# Altium schematic sheet TEST_MECH.SchDoc
size 420 x 297 mm; SheetNumber: 3
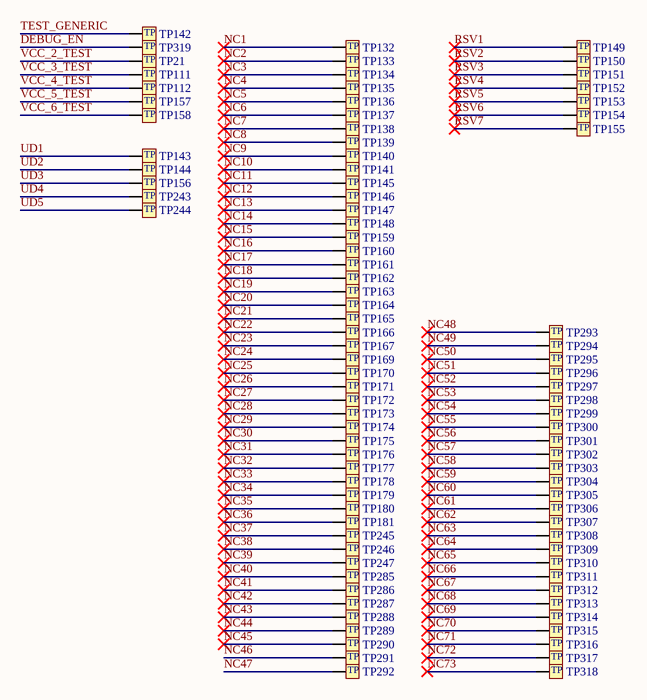
[diagram p0: TEST_MECH.SchDoc]

## Parts
TP21  TP_0P8MM  [TP_0P8MM]  (value not drawn)  (no BOM)
TP111  TP_0P8MM  [TP_0P8MM]  (value not drawn)  (no BOM)
TP112  TP_0P8MM  [TP_0P8MM]  (value not drawn)  (no BOM)
TP132  TP_0P8MM  [TP_0P8MM]  (value not drawn)  (no BOM)
TP133  TP_0P8MM  [TP_0P8MM]  (value not drawn)  (no BOM)
TP134  TP_0P8MM  [TP_0P8MM]  (value not drawn)  (no BOM)
TP135  TP_0P8MM  [TP_0P8MM]  (value not drawn)  (no BOM)
TP136  TP_0P8MM  [TP_0P8MM]  (value not drawn)  (no BOM)
TP137  TP_0P8MM  [TP_0P8MM]  (value not drawn)  (no BOM)
TP138  TP_0P8MM  [TP_0P8MM]  (value not drawn)  (no BOM)
TP139  TP_0P8MM  [TP_0P8MM]  (value not drawn)  (no BOM)
TP140  TP_0P8MM  [TP_0P8MM]  (value not drawn)  (no BOM)
TP141  TP_0P8MM  [TP_0P8MM]  (value not drawn)  (no BOM)
TP142  TP_0P8MM  [TP_0P8MM]  (value not drawn)  (no BOM)
TP143  TP_0P8MM  [TP_0P8MM]  (value not drawn)  (no BOM)
TP144  TP_0P8MM  [TP_0P8MM]  (value not drawn)  (no BOM)
TP145  TP_0P8MM  [TP_0P8MM]  (value not drawn)  (no BOM)
TP146  TP_0P8MM  [TP_0P8MM]  (value not drawn)  (no BOM)
TP147  TP_0P8MM  [TP_0P8MM]  (value not drawn)  (no BOM)
TP148  TP_0P8MM  [TP_0P8MM]  (value not drawn)  (no BOM)
TP149  TP_0P8MM  [TP_0P8MM]  (value not drawn)  (no BOM)
TP150  TP_0P8MM  [TP_0P8MM]  (value not drawn)  (no BOM)
TP151  TP_0P8MM  [TP_0P8MM]  (value not drawn)  (no BOM)
TP152  TP_0P8MM  [TP_0P8MM]  (value not drawn)  (no BOM)
TP153  TP_0P8MM  [TP_0P8MM]  (value not drawn)  (no BOM)
TP154  TP_0P8MM  [TP_0P8MM]  (value not drawn)  (no BOM)
TP155  TP_0P8MM  [TP_0P8MM]  (value not drawn)  (no BOM)
TP156  TP_0P8MM  [TP_0P8MM]  (value not drawn)  (no BOM)
TP157  TP_0P8MM  [TP_0P8MM]  (value not drawn)  (no BOM)
TP158  TP_0P8MM  [TP_0P8MM]  (value not drawn)  (no BOM)
TP159  TP_0P8MM  [TP_0P8MM]  (value not drawn)  (no BOM)
TP160  TP_0P8MM  [TP_0P8MM]  (value not drawn)  (no BOM)
TP161  TP_0P8MM  [TP_0P8MM]  (value not drawn)  (no BOM)
TP162  TP_0P8MM  [TP_0P8MM]  (value not drawn)  (no BOM)
TP163  TP_0P8MM  [TP_0P8MM]  (value not drawn)  (no BOM)
TP164  TP_0P8MM  [TP_0P8MM]  (value not drawn)  (no BOM)
TP165  TP_0P8MM  [TP_0P8MM]  (value not drawn)  (no BOM)
TP166  TP_0P8MM  [TP_0P8MM]  (value not drawn)  (no BOM)
TP167  TP_0P8MM  [TP_0P8MM]  (value not drawn)  (no BOM)
TP169  TP_0P8MM  [TP_0P8MM]  (value not drawn)  (no BOM)
TP170  TP_0P8MM  [TP_0P8MM]  (value not drawn)  (no BOM)
TP171  TP_0P8MM  [TP_0P8MM]  (value not drawn)  (no BOM)
TP172  TP_0P8MM  [TP_0P8MM]  (value not drawn)  (no BOM)
TP173  TP_0P8MM  [TP_0P8MM]  (value not drawn)  (no BOM)
TP174  TP_0P8MM  [TP_0P8MM]  (value not drawn)  (no BOM)
TP175  TP_0P8MM  [TP_0P8MM]  (value not drawn)  (no BOM)
TP176  TP_0P8MM  [TP_0P8MM]  (value not drawn)  (no BOM)
TP177  TP_0P8MM  [TP_0P8MM]  (value not drawn)  (no BOM)
TP178  TP_0P8MM  [TP_0P8MM]  (value not drawn)  (no BOM)
TP179  TP_0P8MM  [TP_0P8MM]  (value not drawn)  (no BOM)
TP180  TP_0P8MM  [TP_0P8MM]  (value not drawn)  (no BOM)
TP181  TP_0P8MM  [TP_0P8MM]  (value not drawn)  (no BOM)
TP243  TP_0P8MM  [TP_0P8MM]  (value not drawn)  (no BOM)
TP244  TP_0P8MM  [TP_0P8MM]  (value not drawn)  (no BOM)
TP245  TP_0P8MM  [TP_0P8MM]  (value not drawn)  (no BOM)
TP246  TP_0P8MM  [TP_0P8MM]  (value not drawn)  (no BOM)
TP247  TP_0P8MM  [TP_0P8MM]  (value not drawn)  (no BOM)
TP285  TP_0P8MM  [TP_0P8MM]  (value not drawn)  (no BOM)
TP286  TP_0P8MM  [TP_0P8MM]  (value not drawn)  (no BOM)
TP287  TP_0P8MM  [TP_0P8MM]  (value not drawn)  (no BOM)
TP288  TP_0P8MM  [TP_0P8MM]  (value not drawn)  (no BOM)
TP289  TP_0P8MM  [TP_0P8MM]  (value not drawn)  (no BOM)
TP290  TP_0P8MM  [TP_0P8MM]  (value not drawn)  (no BOM)
TP291  TP_0P8MM  [TP_0P8MM]  (value not drawn)  (no BOM)
TP292  TP_0P8MM  [TP_0P8MM]  (value not drawn)  (no BOM)
TP293  TP_0P8MM  [TP_0P8MM]  (value not drawn)  (no BOM)
TP294  TP_0P8MM  [TP_0P8MM]  (value not drawn)  (no BOM)
TP295  TP_0P8MM  [TP_0P8MM]  (value not drawn)  (no BOM)
TP296  TP_0P8MM  [TP_0P8MM]  (value not drawn)  (no BOM)
TP297  TP_0P8MM  [TP_0P8MM]  (value not drawn)  (no BOM)
TP298  TP_0P8MM  [TP_0P8MM]  (value not drawn)  (no BOM)
TP299  TP_0P8MM  [TP_0P8MM]  (value not drawn)  (no BOM)
TP300  TP_0P8MM  [TP_0P8MM]  (value not drawn)  (no BOM)
TP301  TP_0P8MM  [TP_0P8MM]  (value not drawn)  (no BOM)
TP302  TP_0P8MM  [TP_0P8MM]  (value not drawn)  (no BOM)
TP303  TP_0P8MM  [TP_0P8MM]  (value not drawn)  (no BOM)
TP304  TP_0P8MM  [TP_0P8MM]  (value not drawn)  (no BOM)
TP305  TP_0P8MM  [TP_0P8MM]  (value not drawn)  (no BOM)
TP306  TP_0P8MM  [TP_0P8MM]  (value not drawn)  (no BOM)
TP307  TP_0P8MM  [TP_0P8MM]  (value not drawn)  (no BOM)
TP308  TP_0P8MM  [TP_0P8MM]  (value not drawn)  (no BOM)
TP309  TP_0P8MM  [TP_0P8MM]  (value not drawn)  (no BOM)
TP310  TP_0P8MM  [TP_0P8MM]  (value not drawn)  (no BOM)
TP311  TP_0P8MM  [TP_0P8MM]  (value not drawn)  (no BOM)
TP312  TP_0P8MM  [TP_0P8MM]  (value not drawn)  (no BOM)
TP313  TP_0P8MM  [TP_0P8MM]  (value not drawn)  (no BOM)
TP314  TP_0P8MM  [TP_0P8MM]  (value not drawn)  (no BOM)
TP315  TP_0P8MM  [TP_0P8MM]  (value not drawn)  (no BOM)
TP316  TP_0P8MM  [TP_0P8MM]  (value not drawn)  (no BOM)
TP317  TP_0P8MM  [TP_0P8MM]  (value not drawn)  (no BOM)
TP318  TP_0P8MM  [TP_0P8MM]  (value not drawn)  (no BOM)
TP319  TP_0P8MM  [TP_0P8MM]  (value not drawn)  (no BOM)

## Nets
DEBUG_EN: TP319.1
NC1: TP132.1
NC2: TP133.1
NC3: TP134.1
NC4: TP135.1
NC5: TP136.1
NC6: TP137.1
NC7: TP138.1
NC8: TP139.1
NC9: TP140.1
NC10: TP141.1
NC11: TP145.1
NC12: TP146.1
NC13: TP147.1
NC14: TP148.1
NC15: TP159.1
NC16: TP160.1
NC17: TP161.1
NC18: TP162.1
NC19: TP163.1
NC20: TP164.1
NC21: TP165.1
NC22: TP166.1
NC23: TP167.1
NC24: TP169.1
NC25: TP170.1
NC26: TP171.1
NC27: TP172.1
NC28: TP173.1
NC29: TP174.1
NC30: TP175.1
NC31: TP176.1
NC32: TP177.1
NC33: TP178.1
NC34: TP179.1
NC35: TP180.1
NC36: TP181.1
NC37: TP245.1
NC38: TP246.1
NC39: TP247.1
NC40: TP285.1
NC41: TP286.1
NC42: TP287.1
NC43: TP288.1
NC44: TP289.1
NC45: TP290.1
NC46: TP291.1
NC47: TP292.1
NC48: TP293.1
NC49: TP294.1
NC50: TP295.1
NC51: TP296.1
NC52: TP297.1
NC53: TP298.1
NC54: TP299.1
NC55: TP300.1
NC56: TP301.1
NC57: TP302.1
NC58: TP303.1
NC59: TP304.1
NC60: TP305.1
NC61: TP306.1
NC62: TP307.1
NC63: TP308.1
NC64: TP309.1
NC65: TP310.1
NC66: TP311.1
NC67: TP312.1
NC68: TP313.1
NC69: TP314.1
NC70: TP315.1
NC71: TP316.1
NC72: TP317.1
NC73: TP318.1
RSV1: TP149.1
RSV2: TP150.1
RSV3: TP151.1
RSV4: TP152.1
RSV5: TP153.1
RSV6: TP154.1
RSV7: TP155.1
TEST_GENERIC: TP142.1
UD1: TP143.1
UD2: TP144.1
UD3: TP156.1
UD4: TP243.1
UD5: TP244.1
VCC_2_TEST: TP21.1
VCC_3_TEST: TP111.1
VCC_4_TEST: TP112.1
VCC_5_TEST: TP157.1
VCC_6_TEST: TP158.1

## Notes on the sheet
- PROJECT
- SIZE
- FILE NAME
- A3
- TITLE
- SHEET
- OF
- REV
- (in symbol TP_0P8MM) TP

## Library data of the parts
TP21 TP111 TP112 TP132-TP167 TP169-TP181 TP243-TP247 TP285-TP319 = TP_0P8MM: OSM Footprint 0P8 LGA Ball